# Altium schematic sheet Magneto_Power_Stage.SchDoc: Power
size 420 x 297 mm; Author: G.Kasprowicz; CompanyName: WUT ISE; DrawnBy: G.Kasprowicz; Organization: WUT ISE; Address1: PW ISE; Address2: Nowowiejska 15/19 00-665 Warsaw; Address3: gkasprow@gmail.com; DocumentNumber: 5; Revision: 2; SheetNumber: 5; SheetTotal: 7; ModifiedBy: -; CheckedDate: -; Title2: Stage; DivGrp: WUT ISE; Designer: G.Kasprowicz; ModifiedDate: -; ProjectName: Sensor Box
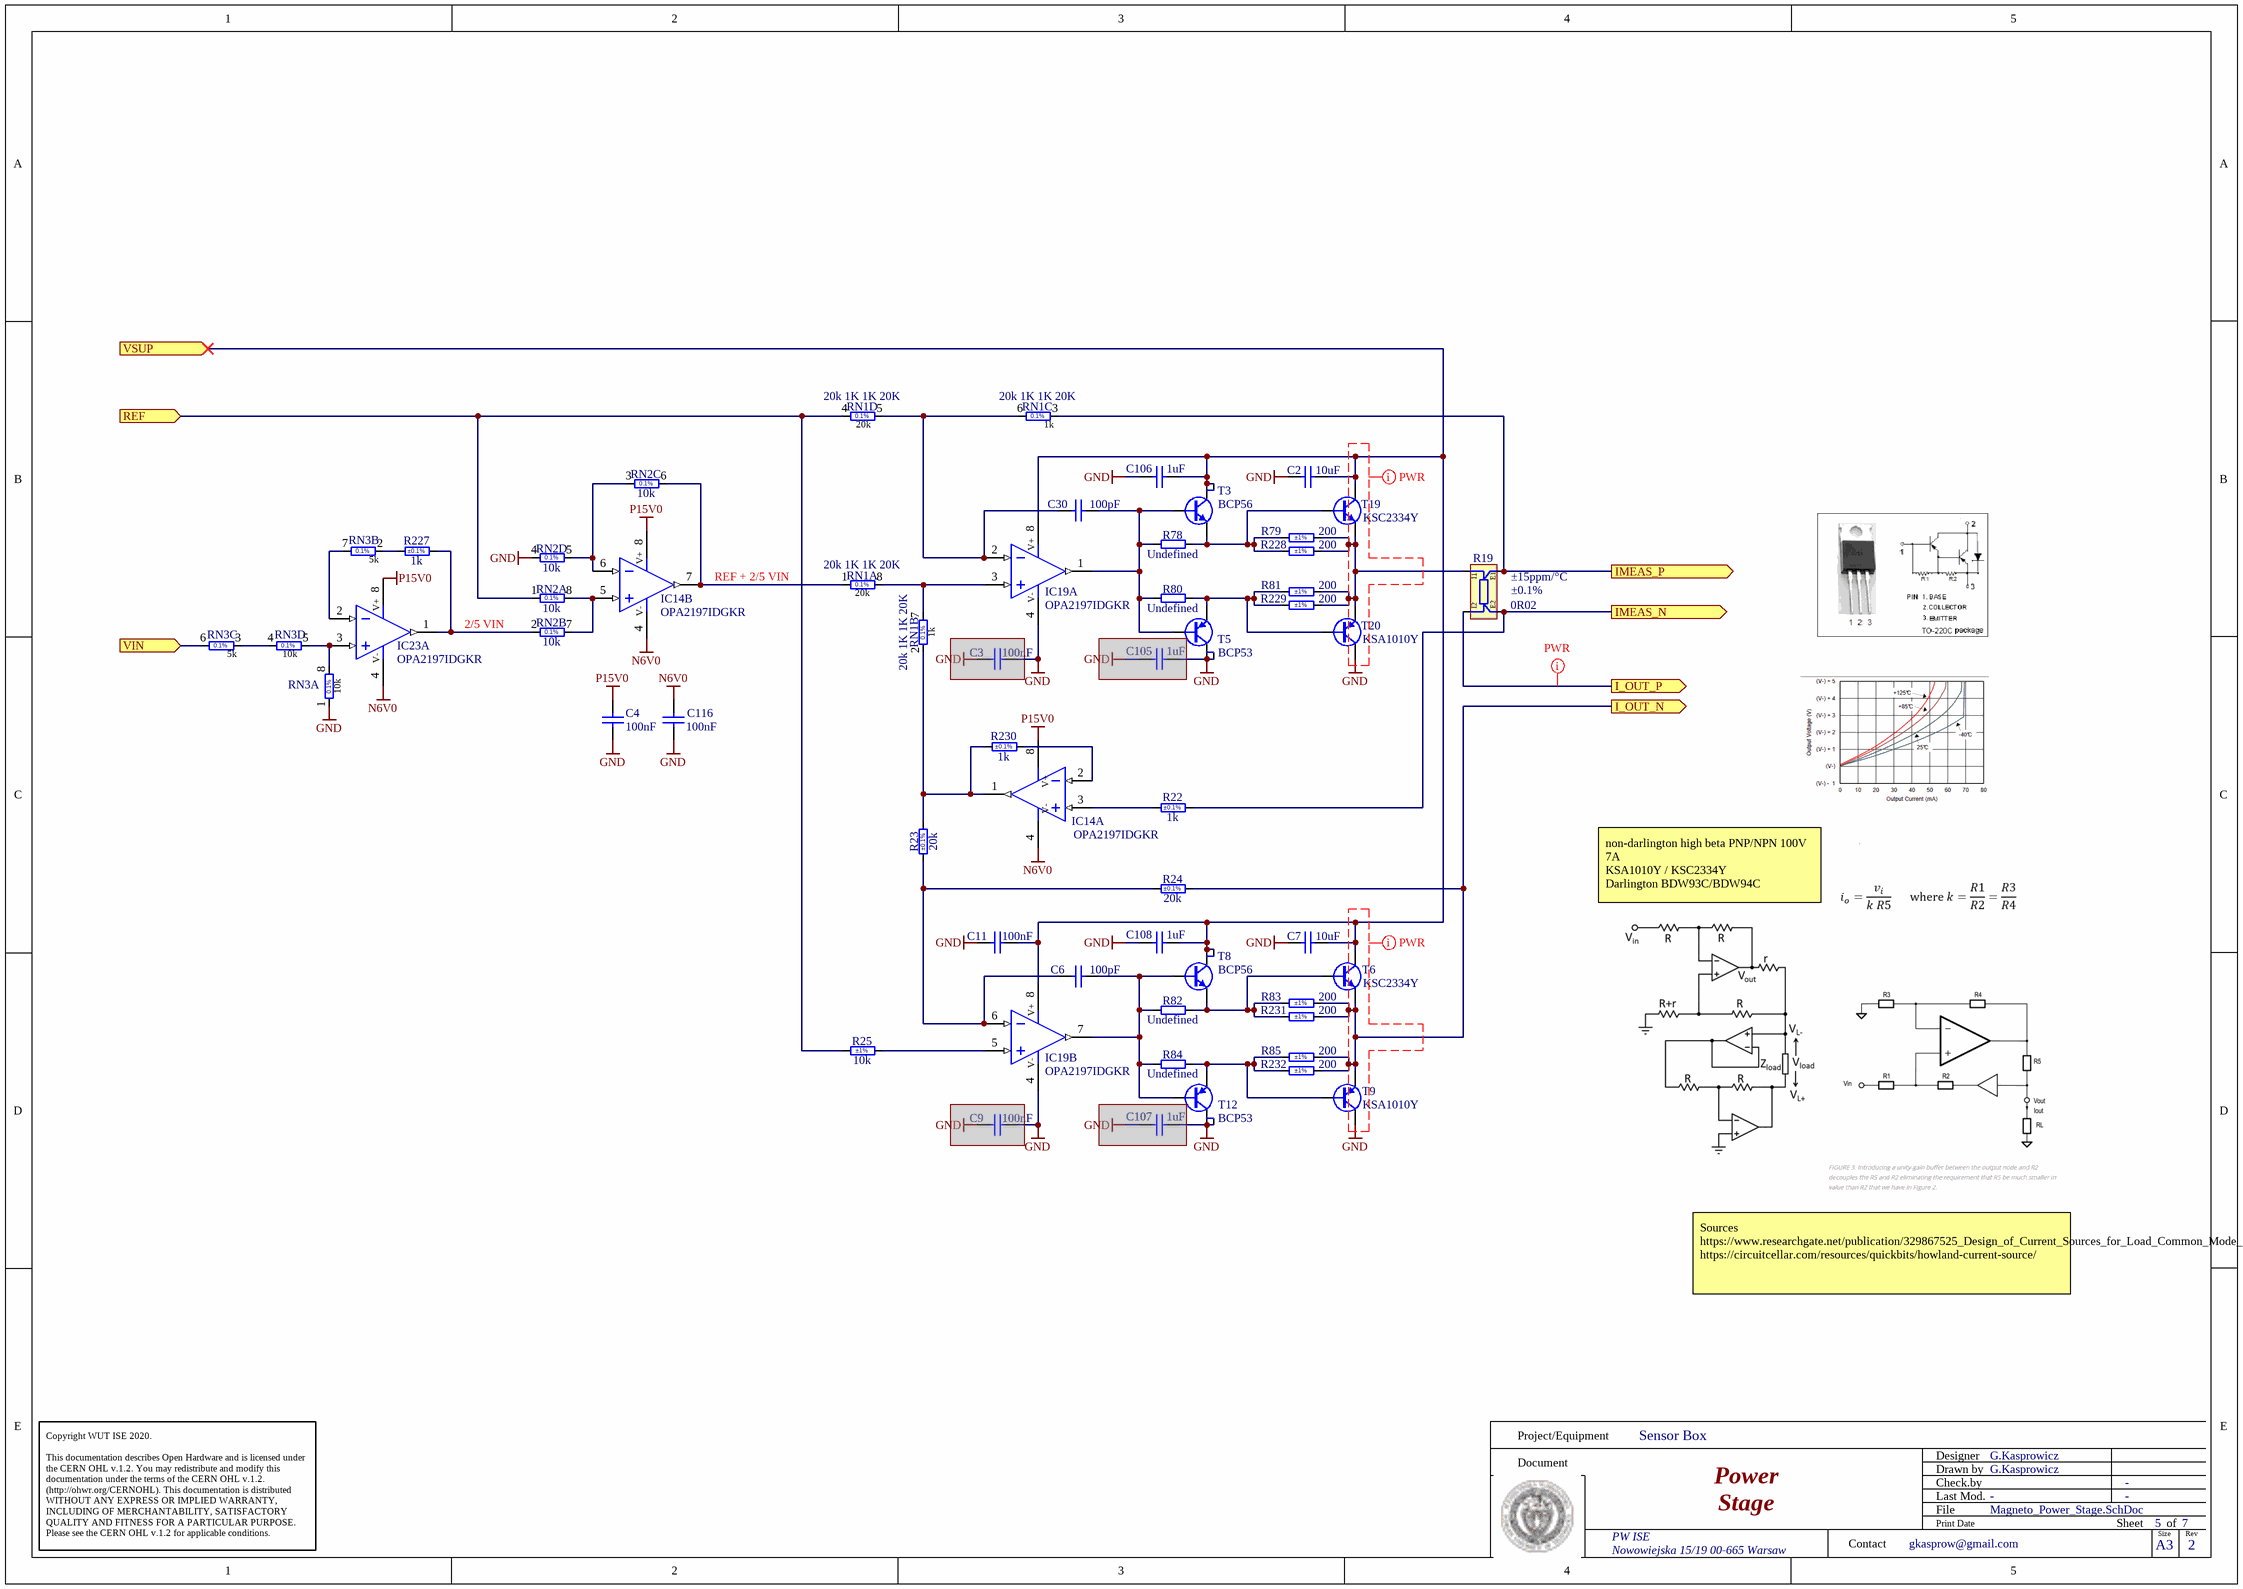
[diagram p0: Magneto_Power_Stage.SchDoc]

## Parts
C2  10uF  [CAPC2012X95N]
C3  100nF  [CAPC1005X55N]  (masked out: inside a compile mask, not in the netlist)
C4  100nF  [CAPC1005X55N]
C6  100pF  [CAPC1608X90N]
C7  10uF  [CAPC2012X95N]
C9  100nF  [CAPC1005X55N]  (masked out: inside a compile mask, not in the netlist)
C11  100nF  [CAPC1005X55N]
C30  100pF  [CAPC1608X90N]
C105  1uF  [CAPC1608X87N]  (masked out: inside a compile mask, not in the netlist)
C106  1uF  [CAPC1608X87N]
C107  1uF  [CAPC1608X87N]  (masked out: inside a compile mask, not in the netlist)
C108  1uF  [CAPC1608X87N]
C116  100nF  [CAPC1005X55N]
IC14  OPA2197IDGKR  [SOP65P490X110-8N]  (parts A,B of 2)
IC19  OPA2197IDGKR  [SOP65P490X110-8N]  (parts A,B of 2)
IC23  OPA2197IDGKR  [SOP65P490X110-8N]  (part A of 2)
R19  0R02  TC: ±15ppm/°C  Tolerance: ±0.1%  [RES_VISHAY_CSM2512_0R007-0R2]
R22  1k  Tolerance: ±0.1%  [RESC1608X55N]
R23  20k  Tolerance: ±0.1%  [RESC1608X55N]
R24  20k  Tolerance: ±0.1%  [RESC1608X55N]
R25  10k  Tolerance: ±1%  [RESC1005X40N]
R78  Undefined  [RESC1608X55N]
R79  200  Tolerance: ±1%  [RESC1608X55N]
R80  Undefined  [RESC1608X55N]
R81  200  Tolerance: ±1%  [RESC1608X55N]
R82  Undefined  [RESC1608X55N]
R83  200  Tolerance: ±1%  [RESC1608X55N]
R84  Undefined  [RESC1608X55N]
R85  200  Tolerance: ±1%  [RESC1608X55N]
R227  1k  Tolerance: ±0.1%  [RESC1608X55N]
R228  200  Tolerance: ±1%  [RESC1608X55N]
R229  200  Tolerance: ±1%  [RESC1608X55N]
R230  1k  Tolerance: ±0.1%  [RESC1608X55N]
R231  200  Tolerance: ±1%  [RESC1608X55N]
R232  200  Tolerance: ±1%  [RESC1608X55N]
RN1  20k 1K 1K 20K  [SOIC127P600X175-8N]  (parts A,B,C,D of 4)
RN2  10k  [SOIC127P600X175-8N]  (parts A,B,C,D of 4)
RN3  10k 5K 5K 10K  [SOIC127P600X175-8N]  (value not drawn)  (parts A,B,C,D of 4)
T3  BCP56  [SOT230P700X180-4N]
T5  BCP53  [SOT230P700X180-4N]
T6  KSC2334Y  [TO-220-h_a]
T8  BCP56  [SOT230P700X180-4N]
T9  KSA1010Y  [TO-220-h_a]
T12  BCP53  [SOT230P700X180-4N]
T19  KSC2334Y  [TO-220-h_a]
T20  KSA1010Y  [TO-220-h_a]

## Ports
I_OUT_N (out), I_OUT_P (out), IMEAS_N (out), IMEAS_P (out), REF (in), VIN (in), VSUP (in)

## Nets
GND: C2.2 C4.1 C7.2 C11.1 C106.1 C108.1 C116.1 IC19.4(V-) RN2.4 RN3.1 T5.2(C) T5.4(C) T9.2(C) T12.2(C) T12.4(C) T20.2(C)
N6V0: C116.2 IC14.4(V-) IC23.4(V-)
P15V0: C4.2 IC14.8(V+) IC23.8(V+)
I_OUT_N: R24.2 R83.2 R85.2 R231.2 R232.2 T6.3(E) T9.3(E) ; port I_OUT_N
I_OUT_P: R19.I2 ; port I_OUT_P
IMEAS_N: R19.E2 R22.2 ; port IMEAS_N
IMEAS_P: R19.E1 RN1.3 ; port IMEAS_P
REF: R25.1 RN1.4 RN2.1 ; port REF
VIN: RN3.6 ; port VIN
VSUP: C2.1 C7.1 C11.2 C106.2 C108.2 IC19.8(V+) T3.2(C) T3.4(C) T6.2(C) T8.2(C) T8.4(C) T19.2(C) ; port VSUP
NetC6_1: C6.1 IC19.6(IN-) R23.1 R24.1
NetC6_2: C6.2 IC19.7(OUT) R82.1 R84.1 T8.1(B) T12.1(B)
NetC30_1: C30.1 IC19.2(IN-) RN1.5 RN1.6
NetC30_2: C30.2 IC19.1(OUT) R78.1 R80.1 T3.1(B) T5.1(B)
NetIC14_1: IC14.1(OUT) R23.2 R230.1 RN1.2
NetIC14_2: IC14.2(IN-) R230.2
NetIC14_3: IC14.3(IN+) R22.1
NetIC14_5: IC14.5(IN+) RN2.7 RN2.8
NetIC14_6: IC14.6(IN-) RN2.3 RN2.5
NetIC14_7: IC14.7(OUT) RN1.1 RN2.6
NetIC19_3: IC19.3(IN+) RN1.7 RN1.8
NetIC19_5: IC19.5(IN+) R25.2
NetIC23_1: IC23.1(OUT) R227.2 RN2.2
NetIC23_2: IC23.2(IN-) RN3.7
NetIC23_3: IC23.3(IN+) RN3.5 RN3.8
NetR19_I1: R19.I1 R79.2 R81.2 R228.2 R229.2 T19.3(E) T20.3(E)
NetR78_2: R78.2 R79.1 R228.1 T3.3(E) T19.1(B)
NetR80_2: R80.2 R81.1 R229.1 T5.3(E) T20.1(B)
NetR82_2: R82.2 R83.1 R231.1 T6.1(B) T8.3(E)
NetR84_2: R84.2 R85.1 R232.1 T9.1(B) T12.3(E)
NetR227_1: R227.1 RN3.2
NetRN3_3: RN3.3 RN3.4

## Layout directives
net class PWR: GND, I_OUT_P

## Notes on the sheet
- REF + 2/5 VIN
- (near RN2) 2/5 VIN
- non-darlington high beta PNP/NPN 100V 7A
  KSA1010Y / KSC2334Y
  Darlington BDW93C/BDW94C
- Sources https://www.researchgate.net/publication/329867525_Design_of_Current_Sources_for_Load_Common_Mode_Optimization/figures?lo=1
  https://circuitcellar.com/resources/quickbits/howland-current-source/
- Project/Equipment
- Document
- Designer
- Drawn by
- Check.by
- Copyright WUT ISE 2020.
  This documentation describes Open Hardware and is licensed under the CERN OHL v.1.2. You may redistribute and modify this documentation under the terms of the CERN OHL v.1.2. (http://ohwr.org/CERNOHL). This documentation is distributed WITHOUT ANY EXPRESS OR IMPLIED WARRANTY, INCLUDING OF MERCHANTABILITY, SATISFACTORY QUALITY AND FITNESS FOR A PARTICULAR PURPOSE. Please see the CERN OHL v.1.2 for applicable conditions.
- Contact
- File
- Last Mod.
- Print Date
- Sheet
- Size
- A3
- of
- Rev
- (in symbol RN_10K_5K_VISHAY_AORN2-1AT3, part A) 10k
- (in symbol RN_10K_5K_VISHAY_AORN2-1AT3, part B) 5k
- (in symbol RN_10K_5K_VISHAY_AORN2-1AT3, part C) 5k
- (in symbol RN_10K_5K_VISHAY_AORN2-1AT3, part D) 10k
- (in symbol RN_20K_1K_VISHAY_AORN20-1A, part A) 20k
- (in symbol RN_20K_1K_VISHAY_AORN20-1A, part B) 1k
- (in symbol RN_20K_1K_VISHAY_AORN20-1A, part C) 1k
- (in symbol RN_20K_1K_VISHAY_AORN20-1A, part D) 20k

## Library data of the parts
C2 C7 = CC0805_10UF_25V_10%_X5R: Non-polarised capacitor; Part Description: SMD Multilayer Chip Ceramic Capacitor; Manufacturer: GENERIC; Manufacturer1 Part Number: GRM21BR61E106KA73L; Voltage: 25V; TC: X5R; Tolerance: ±10%; Part Number: CC0805_10UF_25V_10%_X5R; Component Kind: Standard; Component Type: Standard; Pin Count: 2; Value: 10uF; Status: Preferred; Manufacturer Part Number: CC0805_10UF_25V_10%_X5R; Case: 0805; Mounted: Yes; Socket: No; SMD: Yes; Sense: No; Manufacturer1 Example: MURATA; Manufacturer1 ComponentHeight: 0.95mm; HelpURL: \\cern.ch\dfs\Applications\Altium\Datasheets\CC0805_X5R_MURATA_GRM.pdf; Author: CERN DEM JLC; CreateDate: 25.10.2012; LatestRevisionDate: 06.09.2016
C3 C4 C9 C11 C116 = CC0402_100NF_16V_10%_X5R: Non-polarised capacitor; Part Description: SMD Multilayer Chip Ceramic Capacitor; Manufacturer: GENERIC; Manufacturer1 Part Number: GRM155R61C104KA88D; Voltage: 16V; TC: X5R; Tolerance: ±10%; Part Number: CC0402_100NF_16V_10%_X5R; Component Kind: Standard; Component Type: Standard; Pin Count: 2; Value: 100nF; Status: None; Manufacturer Part Number: CC0402_100NF_16V_10%_X5R; Case: 0402; Mounted: Yes; Socket: No; SMD: Yes; Sense: No; Manufacturer1 Example: MURATA; Manufacturer1 ComponentHeight: 0.55mm; HelpURL: \\cern.ch\dfs\Applications\Altium\Datasheets\CC0402_X5R_MURATA_GRM.pdf; Author: CERN DEM JLC; CreateDate: 10.12.2013; LatestRevisionDate: 10.12.2013
C6 C30 = CC0603_100PF_50V_1%_NP0: Non-polarised capacitor; Part Description: SMD Multilayer Chip Ceramic Capacitor; Manufacturer: GENERIC; Manufacturer1 Part Number: 06035A101FAT2A; Voltage: 50V; TC: C0G/NP0; Tolerance: ±1%; Part Number: CC0603_100PF_50V_1%_NP0; Component Kind: Standard; Component Type: Standard; Pin Count: 2; Value: 100pF; Status: None; Manufacturer Part Number: CC0603_100PF_50V_1%_NP0; Case: 0603; Mounted: Yes; Socket: No; SMD: Yes; Sense: No; Manufacturer1 Example: AVX; Manufacturer1 ComponentHeight: 0.9mm; HelpURL: \\cern.ch\dfs\Applications\Altium\Datasheets\CC0603_C0G_AVX.pdf; Author: CERN DEM JLC; CreateDate: 15.06.2017; LatestRevisionDate: 15.06.2017
C105-C108 = CC0603_1UF_25V_10%_X7R: Non-polarised capacitor; Part Description: SMD Multilayer Chip Ceramic Capacitor; Manufacturer: GENERIC; Manufacturer1 Part Number: GCM188R71E105KA64D; Voltage: 25V; TC: X7R; Tolerance: ±10%; Part Number: CC0603_1UF_25V_10%_X7R; Component Kind: Standard; Component Type: Standard; Pin Count: 2; Value: 1uF; Status: None; Manufacturer Part Number: CC0603_1UF_25V_10%_X7R; Case: 0603; Mounted: Yes; Socket: No; SMD: Yes; Sense: No; Manufacturer1 Example: MURATA; Manufacturer1 ComponentHeight: 0.9mm; HelpURL: \\cern.ch\dfs\Applications\Altium\Datasheets\CC0603_X7R_MURATA.pdf; Author: CERN DEM JLC; CreateDate: 18.01.2011; LatestRevisionDate: 18.01.2011
IC14 IC19 IC23 = OA_OPA2197IDGKR: 36-V, Precision, Rail-to-Rail Input Output, Low Offset Voltage Op Amp 8-VSSOP; Part Description: High-Precision, Low-Noise, Rail-to-Rail Output,10-MHz Op Amp; Manufacturer1: TEXAS INSTRUMENTS; PressFit: No; Bonding: No; Part Number: OPA2197IDGKR; Component Kind: Standard; Component Type: Standard; Device: OPA2197IDGKR; PackageDescription: SOP, 0.65mm pitch; 8 pin, 3.00mm W X 3.00mm L X 1.10mm H body, IPC Medium Density; Manufacturer1 Part Number: OPA2197IDGKR; Pin Count: 8; Case: MSOP8; Mounted: Yes; Socket: No; SMD: Yes; Sense: No; ComponentHeight: 1.1mm; Author: GK; HelpURL: \\cern.ch\dfs\Applications\Altium\Datasheets\OPA2140AIDGK.pdf; CreateDate: 20.04.2017; LatestRevisionDate: 20.04.2017
R19 = R2512_0R02_0.1%_1W_15PPM_VISHAY_CSM: Power and Current Sensing Resistor; Part Description: Bulk Metal® Technology High Precision, Current Sense Metal Strip Resistor; Manufacturer1: VISHAY FOIL RESISTOR; Manufacturer1 Part Number: Y14870R02000B9R; Power: 1W; PressFit: No; Part Number: R2512_0R02_0.1%_1W_15PPM_VISHAY_CSM; Component Kind: Standard; Component Type: Standard; Pin Count: 4; Value: 0R02; Status: None; Case: 2512; Mounted: Yes; Sense: No; Socket: No; SMD: Yes; ComponentHeight: 0.64mm; HelpURL: \\cern.ch\dfs\Applications\Altium\Datasheets\R2512_VISHAY_CSM.pdf; Author: CERN DEM MR; CreateDate: 19.02.2018; LatestRevisionDate: 19.02.2018
R22 R227 R230 = R0603_1K_0.1%_0.063W_10PPM: Resistor - 0.1%; Part Description: Thin Film Chip Resistor; Manufacturer: GENERIC; Manufacturer1: TYCO HOLSWORTHY; Manufacturer1 Part Number: RN73C1J1K0BTG; Power: 0.063W; TC: ±10ppm; PressFit: No; Part Number: R0603_1K_0.1%_0.063W_10PPM; Component Kind: Standard; Component Type: Standard; Pin Count: 2; Value: 1k; Status: Not Recommended; Manufacturer Part Number: R0603_1K_0.1%_0.063W_10PPM; Case: 0603; Mounted: Yes; Sense: No; Socket: No; SMD: Yes; Manufacturer1 ComponentHeight: 0.55mm; HelpURL: \\cern.ch\dfs\Applications\Altium\Datasheets\R0603_Tyco_RN73.pdf; Author: CERN DEM BC; CreateDate: 23.05.2016; LatestRevisionDate: 23.05.2016
R23 R24 = R0603_20K_0.1%_0.063W_10PPM: Resistor - 0.1%; Part Description: Thin Film Chip Resistor; Manufacturer: GENERIC; Manufacturer1: TYCO HOLSWORTHY; Manufacturer1 Part Number: RN73C1J20KBTDF; Power: 0.063W; TC: ±10ppm; PressFit: No; Part Number: R0603_20K_0.1%_0.063W_10PPM; Component Kind: Standard; Component Type: Standard; Pin Count: 2; Value: 20k; Status: Not Recommended; Manufacturer Part Number: R0603_20K_0.1%_0.063W_10PPM; Case: 0603; Mounted: Yes; Sense: No; Socket: No; SMD: Yes; Manufacturer1 ComponentHeight: 0.5mm; HelpURL: \\cern.ch\dfs\Applications\Altium\Datasheets\R0603_Tyco_RN73.pdf; Author: CERN DEM JLC; CreateDate: 03.12.2007; LatestRevisionDate: 13.03.2008
R25 = R0402_10K_1%_0.0625W_100PPM: Resistor - 1%; Part Description: General Purpose Thick Film Chip Resistor; Manufacturer: GENERIC; Manufacturer1: Vishay; Manufacturer1 Part Number: RCA040210K0FKED; TC: ±100ppm/°C; PressFit: No; Part Number: R0402_10K_1%_0.0625W_100PPM; Component Kind: Standard; Component Type: Standard; Pin Count: 2; Value: 10k; Status: Not Recommended; Power: 0.0625W; Manufacturer Part Number: R0402_10K_1%_0.0625W_100PPM; Case: 0402; Mounted: Yes; Sense: No; Socket: No; SMD: Yes; Manufacturer1 ComponentHeight: 0.4mm; HelpURL: \\cern.ch\dfs\Applications\Altium\Datasheets\R0402_Phycomp_RC0402.pdf; Author: CERN DEM JLC; CreateDate: 03.12.2007; LatestRevisionDate: 17.10.2012
R78 R80 R82 R84 = R0603_NO-VALUE: Resistor; Part Description: Reserved Footprint For a 0603 (1608) Chip Resistor; PressFit: No; Mounted: No; Part Number: R0603_NO-VALUE; Component Kind: Standard; Component Type: Standard; Pin Count: 2; Value: Undefined; Status: None; Manufacturer: Undefined; Manufacturer Part Number: R0603_NO-VALUE; Case: 0603; Sense: No; Socket: No; SMD: Yes; Manufacturer1 Example: Undefined; Manufacturer1 Part Number: Undefined; Manufacturer1 ComponentHeight: Undefined; HelpURL: Undefined; Author: CERN DEM JLC; CreateDate: 03.12.2007; LatestRevisionDate: 13.03.2008
R79 R81 R83 R85 R228 R229 R231 R232 = R0603_200R_1%_0.1W_100PPM: Resistor - 1%; Part Description: General Purpose Thick Film Chip Resistor; Manufacturer: GENERIC; Manufacturer1: Vishay; Manufacturer1 Part Number: CRCW0603200RFKEA; Power: 0.1W; TC: ±100ppm/°C; PressFit: No; Part Number: R0603_200R_1%_0.1W_100PPM; Component Kind: Standard; Component Type: Standard; Pin Count: 2; Value: 200; Status: Preferred; Manufacturer Part Number: R0603_200R_1%_0.1W_100PPM; Case: 0603; Mounted: Yes; Sense: No; Socket: No; SMD: Yes; Manufacturer1 ComponentHeight: 0.55mm; HelpURL: \\cern.ch\dfs\Applications\Altium\Datasheets\R0603_NIC_NRC.pdf; Author: CERN DEM JLC; CreateDate: 03.12.2007; LatestRevisionDate: 13.03.2008
RN1 = RN_20K_1K_VISHAY_AORN20-1A: DIL8 Resistor Network 4 Resistors 4xR 10k-1k-1k-10k 0.1%; Part Number: RN_20K_1K_VISHAY_AORN10-1A; Part Description: Dual-In-Line Thin Film Precision Automotive Resistors Network, (4 Isolated) - AORN Series; Manufacturer1: VISHAY DALE; Manufacturer1 Part Number: AORN20-1AT5; Power: 4x0.1W; TC: ±25ppm/°C; PressFit: No; Component Kind: Standard; Component Type: Standard; Pin Count: 8; Value: 20k 1K 1K 20K; Sense: No; Tolerance: 0.1%; Case: SOIC8; Mounted: Yes; Socket: No; SMD: Yes; ComponentHeight: 1.73mm; HelpURL: \\cern.ch\dfs\Applications\Altium\Datasheets\RN_VISHAY_AORN.pdf; Author: GK; CreateDate: 20.02.2017; LatestRevisionDate: 15.01.2020
RN2 = RN_10K_VISHAY_AORN1002A: DIL8 Resistor Network 4 Isolated Resistor 0.1%; Part Description: Dual-In-Line Thin Film Precision Automotive Resistors Network, (4 Isolated) - AORN Series; Manufacturer1: VISHAY DALE; Manufacturer1 Part Number: AORN1002AT5; Power: 4x0.1W; TC: ±25ppm/°C; PressFit: No; Part Number: RN_10K_VISHAY_AORN1002A; Component Kind: Standard; Component Type: Standard; Pin Count: 8; Value: 10k; Sense: No; Tolerance: 0.1%; Case: SOIC8; Mounted: Yes; Socket: No; SMD: Yes; ComponentHeight: 1.73mm; HelpURL: \\cern.ch\dfs\Applications\Altium\Datasheets\RN_VISHAY_AORN.pdf; Author: CERN DEM JLC; CreateDate: 20.02.2017; LatestRevisionDate: 03.05.2017
RN3 = RN_10K_5K_VISHAY_AORN2-1AT3: DIL8 Resistor Network 4 Resistors 10k-5k-5k-10k 0.1%; Part Description: Dual-In-Line Thin Film Precision Automotive Resistors Network, (4 Isolated) - AORN Series; Manufacturer1: VISHAY DALE; Manufacturer1 Part Number: AORN2-1AT5; Power: 4x0.1W; TC: ±25ppm/°C; PressFit: No; Part Number: RN_10K_5K_VISHAY_AORN2-1AT3; Component Kind: Standard; Component Type: Standard; Pin Count: 8; Value: 10k 5K 5K 10K; Sense: No; Tolerance: 0.1%; Case: SOIC8; Mounted: Yes; Socket: No; SMD: Yes; ComponentHeight: 1.73mm; HelpURL: \\cern.ch\dfs\Applications\Altium\Datasheets\RN_VISHAY_AORN.pdf; Author: CERN DEM JLC; CreateDate: 20.02.2017; LatestRevisionDate: 20.02.2017
T3 T8 = BCP56: NPN Transistor; Part Description: 80V 1A NPN Medium Power Transistor; Manufacturer1: NXP SEMICONDUCTORS; Manufacturer1 Part Number: BCP56-16HX; PressFit: No; Bonding: No; Part Number: BCP56; Component Kind: Standard; Component Type: Standard; Device: BCP56; PackageDescription: SOT223, 2.30mm Pitch; 4 Pin, 3.70mm W X 6.70mm L X 1.80mm H body, IPC Medium Density; Pin Count: 4; Case: SOT223; Mounted: Yes; Socket: No; SMD: Yes; Sense: No; ComponentHeight: 1.8mm; HelpURL: \\cern.ch\dfs\Applications\Altium\Datasheets\BCP56.pdf; Author: CERN DEM JLC; CreateDate: 25.06.2008; LatestRevisionDate: 25.06.2008
T5 T12 = BCP53: PNP Transistor; Part Description: -80V -1A PNP Medium Power Transistor; Manufacturer1: NXP SEMICONDUCTORS; Manufacturer1 Part Number: BCP53-16HX; PressFit: No; Bonding: No; Part Number: BCP53; Component Kind: Standard; Component Type: Standard; Device: BCP53; PackageDescription: SOT223, 2.30mm Pitch; 4 Pin, 3.70mm W X 6.70mm L X 1.80mm H body, IPC Medium Density; Pin Count: 4; Case: SOT223; Mounted: Yes; Socket: No; SMD: Yes; Sense: No; ComponentHeight: 1.8mm; HelpURL: \\cern.ch\dfs\Applications\Altium\Datasheets\BCP53.pdf; Author: CERN DEM JLC; CreateDate: 25.06.2008; LatestRevisionDate: 25.06.2008
T6 T19 = Q_KSC2334Y: NPN Transistor; Part Description: 100V 7A NPN Epitaxial Silicon Transistor; Manufacturer: ON SEMICONDUCTOR; PressFit: No; Bonding: No; Part Number: KSC2334Y; Component Kind: Standard; Component Type: Standard; Device: KSC2334Y; Footprint: TO-220-HFLIP; PackageDescription: TO-220 3-Terminal + Tab - Flipped Horizontal Mount; Manufacturer Part Number: KSC2334Y; Pin Count: 3; Case: TO-220; Mounted: Yes; Socket: No; SMD: No; Sense: No; ComponentHeight: 4.69mm; HelpURL: \\cern.ch\dfs\Applications\Altium\Datasheets\BDW93C.pdf; Author: GK; CreateDate: 10.05.2022; LatestRevisionDate: 10.05.2022; Manufacturer1 part Number: KSC2334Y; Manufacturer1: ON SEMICONDUCTOR
T9 T20 = Q_KSA1010Y: PNP Transistor; Part Description: 100V 7A PNP Epitaxial Silicon Transistor; Manufacturer: ON SEMICONDUCTOR; Manufacturer1 Part Number: MJE15029G; PressFit: No; Bonding: No; Part Number: KSA1010Y; Component Kind: Standard; Component Type: Standard; Device: KSA1010Y; Footprint: TO-220-HFLIP; PackageDescription: TO-220 3-Terminal + Tab - Flipped Horizontal Mount; Manufacturer Part Number: KSA1010Y; Pin Count: 3; Case: TO-220; Mounted: Yes; Socket: No; SMD: No; Sense: No; ComponentHeight: 4.69mm; HelpURL: \\cern.ch\dfs\Applications\Altium\Datasheets\BDW94C.pdf; Author: GK; CreateDate: 10.05.2022; LatestRevisionDate: 10.05.2022; Manufacturer1: ON SEMICONDUCTOR